# EAGLE design lasertag (EAGLE 5.07)
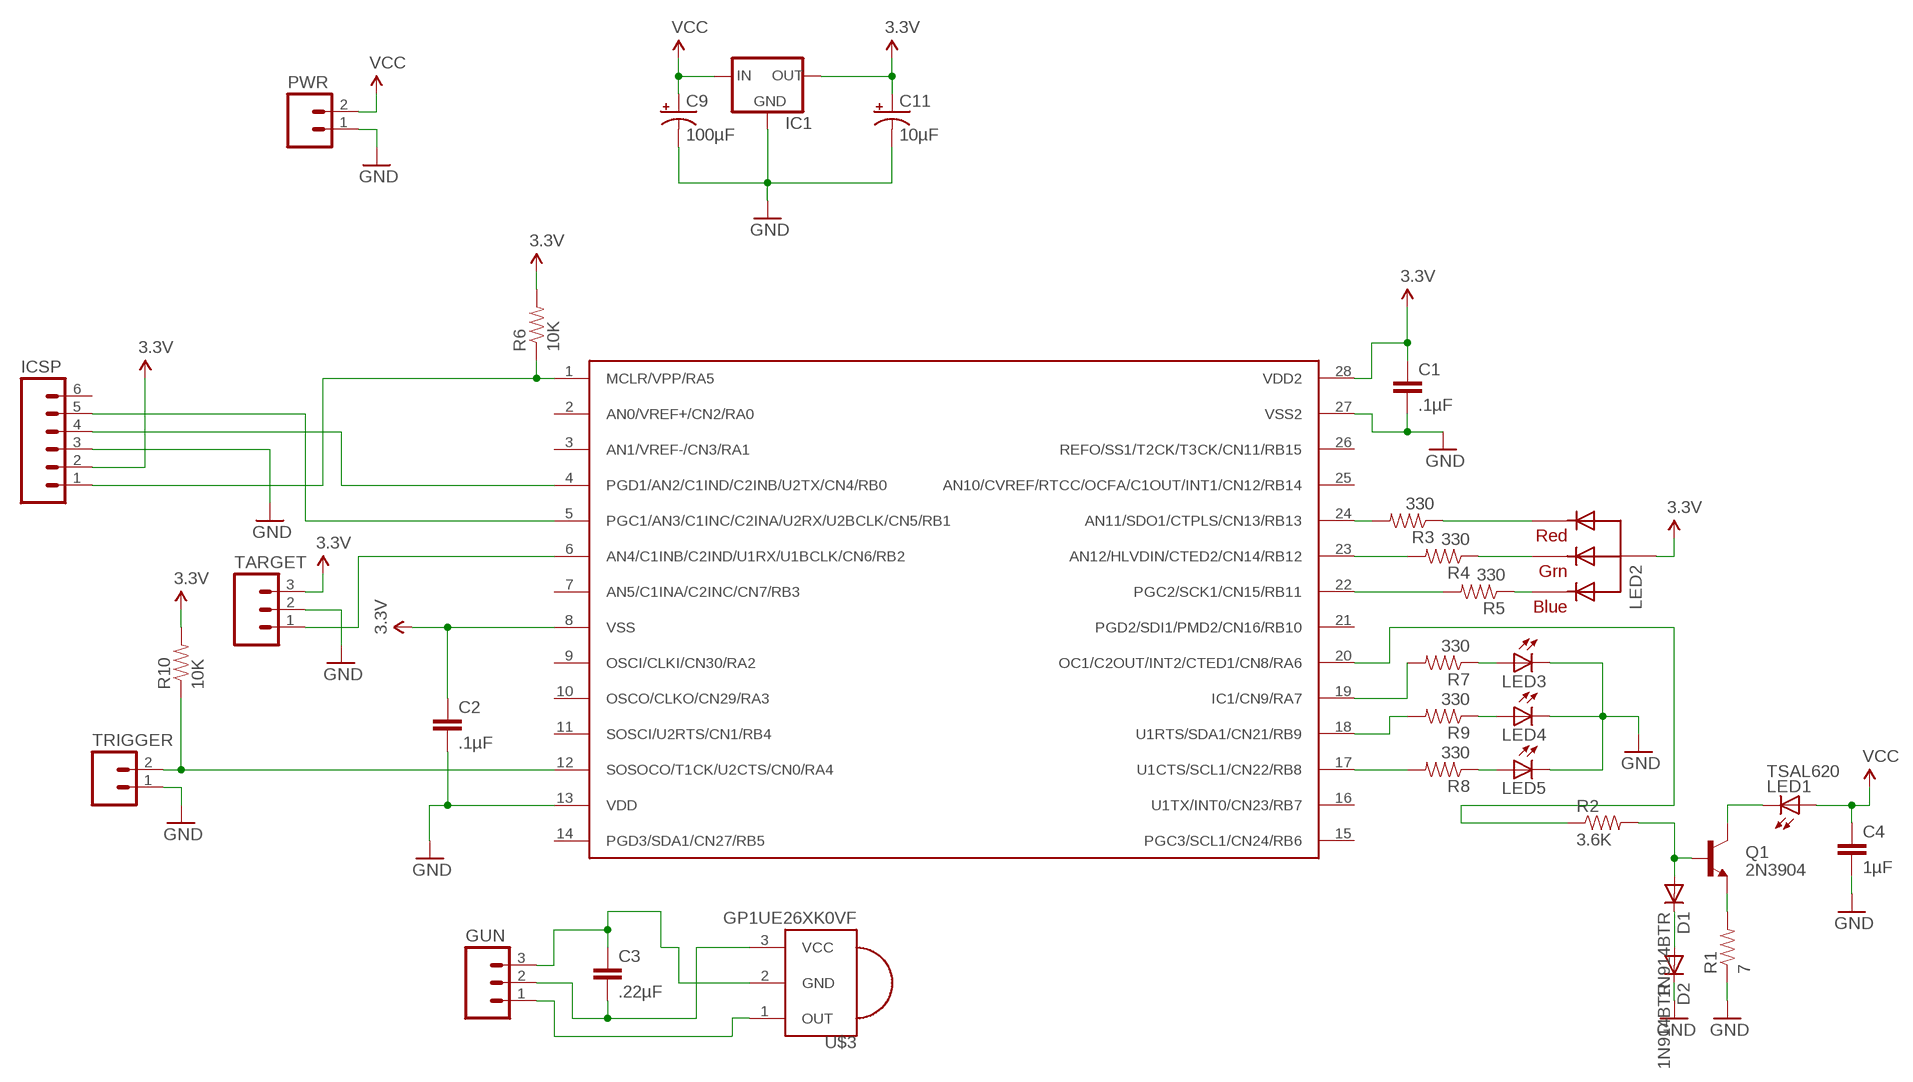
[diagram p0: schematic, sheet 1]

## Parts
C1  .1µF  CAPPTH  [CAP-PTH-SMALL]
C2  .1µF  CAPPTH  [CAP-PTH-SMALL]
C3  .22µF  CAPPTH2  [CAP-PTH-SMALL2]
C4  1µF  CAPPTH1  [CAP-PTH-5MM]
C9  100µF  CAP_POLPTH1  [CPOL-RADIAL-100UF-25V]
C11  10µF  CAP_POLPTH2  [CPOL-RADIAL-10UF-25V]
D1  1N914BTR  DIODE1N4148  [DIODE-1N4148]
D2  1N914BTR  DIODE1N4148  [DIODE-1N4148]
GUN  M03LOCK  [1X03_LOCK]
IC1  V_REG_78XXTO-92  [TO-92]
ICSP  M06LOCK  [1X06_LOCK]
LED1  TSAL620  LED5MM  [LED5MM]
LED2  RGBLED_CA-5MM  [LED5MMRGB]
LED3  LED3MM  [LED3MM]
LED4  LED3MM  [LED3MM]
LED5  LED3MM  [LED3MM]
PWR  M02LOCK  [1X02_LOCK]
Q1  2N3904  TRANSISTOR_NPNTO92  [TO-92]
R1  7  RESISTORPTH-1/4W  [AXIAL-0.4]
R2  3.6K  RESISTORPTH-1/4W  [AXIAL-0.4]
R3  330  RESISTORPTH-1/4W  [AXIAL-0.4]
R4  330  RESISTORPTH-1/4W  [AXIAL-0.4]
R5  330  RESISTORPTH-1/4W  [AXIAL-0.4]
R6  10K  RESISTORPTH-1/4W  [AXIAL-0.4]
R7  330  RESISTORPTH-1/4W  [AXIAL-0.4]
R8  330  RESISTORPTH-1/4W  [AXIAL-0.4]
R9  330  RESISTORPTH-1/4W  [AXIAL-0.4]
R10  10K  RESISTORPTH-1/4W  [AXIAL-0.4]
TARGET  M03LOCK  [1X03_LOCK]
TRIGGER  M02LOCK  [1X02_LOCK]
U$2  PIC24F16KA102  [DIL28]
U$3  GP1UE26XK0VF  PNA460XM  [PNA460XM]

## Nets
3.3V: C1.1 C2.1 C11.1(+) IC1.3(OUT) ICSP.2 LED2.2(VCC) R6.P$2 R10.P$2 TARGET.3 U$2.8(VSS) U$2.28(VDD2)
B: D1.A Q1.2(B) R2.P$2
C: LED1.K(C) Q1.3(C)
E: Q1.1(E) R1.P$2
GND: C1.2 C2.2 C4.2 C9.2(-) C11.2(-) D2.C IC1.1(GND) ICSP.3 LED3.K(C) LED4.K(C) LED5.K(C) PWR.1 R1.P$1 TARGET.2 TRIGGER.1 U$2.13(VDD) U$2.27(VSS2)
N$1: R7.P$2 U$2.19(IC1/CN9/RA7)
N$3: ICSP.1 R6.P$1 U$2.1(MCLR/VPP/RA5)
N$4: ICSP.4 U$2.4(PGD1/AN2/C1IND/C2INB/U2TX/CN4/RB0)
N$5: ICSP.5 U$2.5(PGC1/AN3/C1INC/C2INA/U2RX/U2BCLK/CN5/RB1)
N$7: D1.C D2.A
N$10: R2.P$1 U$2.20(OC1/C2OUT/INT2/CTED1/CN8/RA6)
N$12: R4.P$2 U$2.23(AN12/HLVDIN/CTED2/CN14/RB12)
N$13: R5.P$2 U$2.22(PGC2/SCK1/CN15/RB11)
N$14: LED2.3(GREEN) R4.P$1
N$15: LED2.4(BLUE) R5.P$1
N$16: TARGET.1 U$2.6(AN4/C1INB/C2IND/U1RX/U1BCLK/CN6/RB2)
N$17: LED3.A R7.P$1
N$18: LED4.A R9.P$1
N$19: R3.P$2 U$2.24(AN11/SDO1/CTPLS/CN13/RB13)
N$20: LED2.1(RED) R3.P$1
N$21: LED5.A R8.P$1
N$23: R9.P$2 U$2.18(U1RTS/SDA1/CN21/RB9)
N$24: R8.P$2 U$2.17(U1CTS/SCL1/CN22/RB8)
N$25: R10.P$1 TRIGGER.2 U$2.12(SOSOCO/T1CK/U2CTS/CN0/RA4)
TARGET_GND: C3.2 GUN.2 U$3.3(VCC)
TARGET_VCC: C3.1 GUN.3 U$3.2(GND)
TARGETOUT: GUN.1 U$3.1(OUT)
VCC: C4.1 C9.1(+) IC1.2(IN) LED1.A PWR.2
Unconnected: ICSP.6 U$2.2(AN0/VREF+/CN2/RA0) U$2.3(AN1/VREF-/CN3/RA1) U$2.7(AN5/C1INA/C2INC/CN7/RB3) U$2.9(OSCI/CLKI/CN30/RA2) U$2.10(OSCO/CLKO/CN29/RA3) U$2.11(SOSCI/U2RTS/CN1/RB4) U$2.14(PGD3/SDA1/CN27/RB5) U$2.15(PGC3/SCL1/CN24/RB6) U$2.16(U1TX/INT0/CN23/RB7) U$2.21(PGD2/SDI1/PMD2/CN16/RB10) U$2.25(AN10/CVREF/RTCC/OCFA/C1OUT/INT1/CN12/RB14) U$2.26(REFO/SS1/T2CK/T3CK/CN11/RB15)

## Library data of the parts
C1-C4 = SparkFun:CAP: Capacitor Standard 0603 ceramic capacitor, and 0.1" leaded capacitor.
C9 C11 = SparkFun:CAP_POL: Capacitor Polarized These are standard SMD and PTH capacitors. Normally 10uF, 47uF, and 100uF in electrolytic and tantalum varieties. Always verify the external diameter of the through hole cap, it varies with capacity, voltage, and manufacturer. The EIA devices should be standard.
D1 D2 = SparkFun:DIODE: Diode These are standard reverse protection diodes and small signal diodes. SMA package can handle up to about 1A. SOD-323 can handle about 200mA. What the SOD-323 package when ordering, there are some mfgs out there that are 5-pin packages.
GUN TARGET = SparkFun:M03: Header 3 Standard 3-pin 0.1" header. Use with straight break away headers (SKU : PRT-00116), right angle break away headers (PRT-00553), swiss pins (PRT-00743), machine pins (PRT-00117), and female headers (PRT-00115). Molex polarized connector foot print use with SKU : PRT-08232 with associated crimp pins and housings.
IC1 = SparkFun:V_REG_78XX: Voltage Regulator Standard 7805 5V regulator. IGO (Input Ground Output). Spark Fun Electronics SKU : COM-00107
ICSP = SparkFun:M06: Header 6 Standard 6-pin 0.1" header. Use with straight break away headers (SKU : PRT-00116), right angle break away headers (PRT-00553), swiss pins (PRT-00743), machine pins (PRT-00117), and female headers (PRT-00115). Molex polarized connector foot print use with SKU : PRT-08094 with associated crimp pins and housings. NOTES ON THE VARIANTS LOCK and LOCK_LONGPADS... This footprint was designed to help hold the alignment of a through-hole component (i.e. 6-pin header) while soldering it into place. You may notice that each hole has been shifted either up or down by 0.005 of an inch from it's more standard position (which is a perfectly straight line). This slight alteration caused the pins (the squares in the middle) to touch the edges of the holes. Because they are alternating, it causes a "brace" to hold the component in place. 0.005 has proven to be the perfect amount of "off-center" position when using our standard breakaway headers. Although looks a little odd when you look at the bare footprint, once you have a header in there, the alteration is very hard to notice. Also, if you push a header all the way into place, it is covered up entirely on the bottom side. This idea of altering the position of holes to aid alignment will be further integrated into the Sparkfun Library for other footprints. It can help hold any component with 3 or more connection pins.
LED1 LED3-LED5 = adafruit:LED: LED OSRAM: - CHIPLED LG R971, LG N971, LY N971, LG Q971, LY Q971, LO R971, LY R971 LH N974, LH R974 LS Q976, LO Q976, LY Q976 LO Q996 - Hyper CHIPLED LW Q18S LB Q993, LB Q99A, LB R99A - SideLED LS A670, LO A670, LY A670, LG A670, LP A670 LB A673, LV A673, LT A673, LW A673 LH A674 LY A675 LS A676, LA A676, LO A676, LY A676, LW A676 LS A679, LY A679, LG A679 - Hyper Micro SIDELED® LS Y876, LA Y876, LO Y876, LY Y876 LT Y87S - SmartLED LW L88C, LW L88S LB L89C, LB L89S, LG L890 LS L89K, LO L89K, LY L89K LS L896, LA L896, LO L896, LY L896 - TOPLED LS T670, LO T670, LY T670, LG T670, LP T670 LSG T670, LSP T670, LSY T670, LOP T670, LYG T670 LG T671, LOG T671, LSG T671 LB T673, LV T673, LT T673, LW T673 LH T674 LS T676, LA T676, LO T676, LY T676, LB T676, LH T676, LSB T676, LW T676 LB T67C, LV T67C, LT T67C, LS T67K, LO T67K, LY T67K, LW E67C LS E67B, LA E67B, LO E67B, LY E67B, LB E67C, LV E67C, LT E67C LW T67C LS T679, LY T679, LG T679 LS T770, LO T770, LY T770, LG T770, LP T770 LB T773, LV T773, LT T773, LW T773 LH T774 LS E675, LA E675, LY E675, LS T675 LS T776, LA T776, LO T776, LY T776, LB T776 LHGB T686 LT T68C, LB T68C - Hyper Mini TOPLED® LB M676 - Mini TOPLED Santana® LG M470 LS M47K, LO M47K, LY M47K Source: http://www.osram.convergy.de/
LED2 = adafruit:RGBLED_CA: RGB LED, common-anode 5MM Staggered pins 5mm Piranha package http://www.ladyada.net/library/pcb/eaglelibrary.html
PWR TRIGGER = SparkFun:M02: Header 2 Standard 2-pin 0.1" header. Use with straight break away headers (SKU : PRT-00116), right angle break away headers (PRT-00553), swiss pins (PRT-00743), machine pins (PRT-00117), and female headers (PRT-00115). Molex polarized connector foot print use with SKU : PRT-08233 with associated crimp pins and housings.
Q1 = SparkFun:TRANSISTOR_NPN: Transistor NPN BJT configuration in SOT23 package. MMBT2222 is the common NPN we use. Double check BCE configuration again layout.
R1-R10 = SparkFun:RESISTOR: Resistor Basic schematic elements and footprints for 0603, 1206, and PTH resistors.
U$2 = custom:PIC24F16KA102: 20/28-Pin General Purpose, 16-Bit Flash Microcontrollers with nanoWatt XLP? Technology
U$3 = adafruit:PNA460XM: IR 38KHz receiver PNA4602 and related receivers http://www.ladyada.net/library/pcb/eaglelibrary.html

## Net classes
0 default: width 0.406 mm
1 ground: width 2 mm
2 power: width 2 mm

## Board
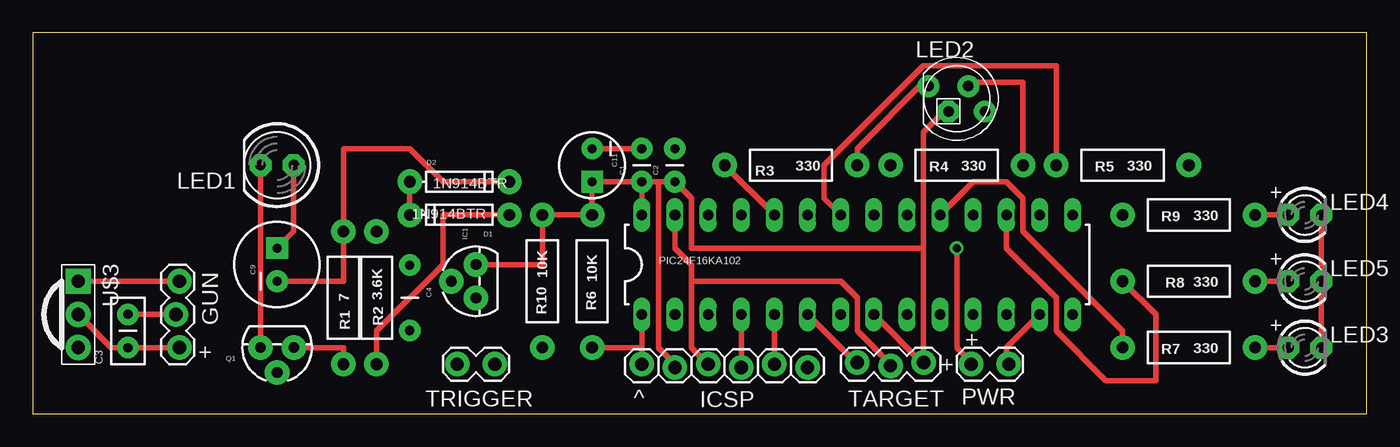
[diagram p1: board, top side]
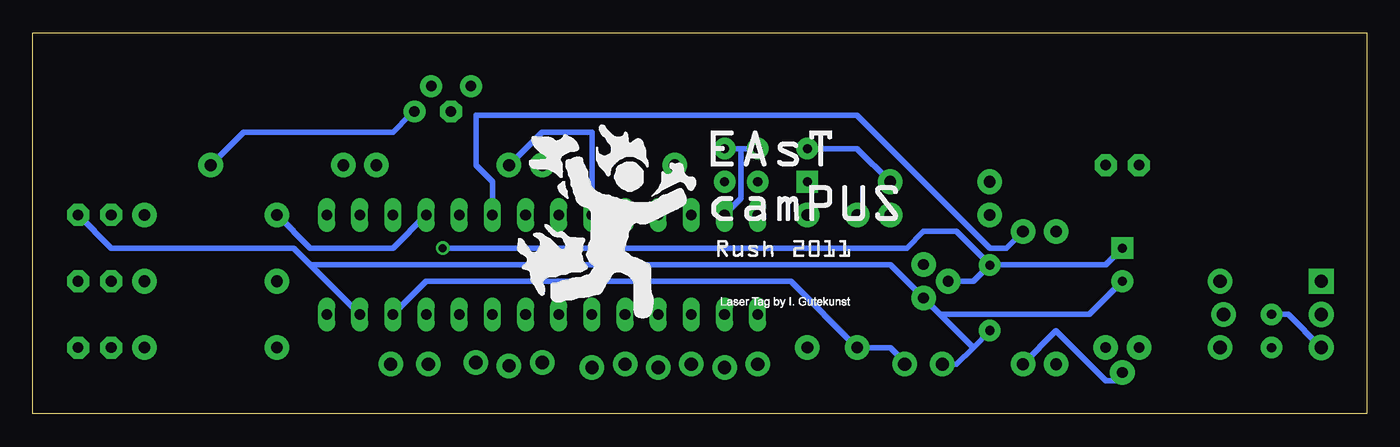
[diagram p2: board, bottom side, seen from below]

Size 102.22 x 29.2 mm. Coordinates in mm from the lower left corner, seen from the top.
Outline: 0,0 102.22,0 102.22,29.2 0,29.2 0,0
Copper layers (1*16): Top 0.0356mm / dielectric 1.5011mm / Bottom 0.0356mm
Design rules "typical_4pcb": minimum track width 10mil, minimum drill 15mil, track to track 6mil, track to pad 6mil, pad to pad 6mil, via to via 6mil, smd to smd 6mil, copper to edge 15mil, drill to drill 8mil, minimum pad ring 10mil, minimum via ring 8mil, stop-mask expansion 4mil, vias tented up to drill 0mil, thermal gap 10mil

### Footprints (pad centres in the part's own frame; a part is rotated, then mirrored left to right if it is on the bottom)
CAP-PTH-SMALL = drill 0.7 pad 1.651 round: 1 0,0; 2 2.54,0
CAP-PTH-SMALL2 = drill 0.7 pad 1.651 round: 1 0,0; 2 2.54,0
CAP-PTH-5MM = drill 0.7 pad 1.651 round: 1 -2.5,0; 2 2.5,0
CPOL-RADIAL-100UF-25V = drill 0.7 pad 1.651 square: 1 1.27,0 | drill 0.7 pad 1.651 round: 2 -1.27,0
CPOL-RADIAL-10UF-25V = drill 0.7 pad 1.651 square: 1 1.27,0 | drill 0.7 pad 1.651 round: 2 -1.27,0
DIODE-1N4148 = drill 0.9 pad 1.88 round: A -3.81,0; C 3.81,0
1X03_LOCK = drill 1.016 pad 1.88 round: 1 0,0.127; 2 2.54,-0.127; 3 5.08,0.127
TO-92 = drill 0.813 pad 1.88 round: 1 -1.27,0; 2 0,1.905; 3 1.27,0
1X06_LOCK = drill 1.016 pad 1.88 round: 1 0,0; 2 2.54,-0.254; 3 5.08,0; 4 7.62,-0.254; 5 10.16,0; 6 12.7,-0.254
LED5MM = drill 0.813 pad 1.676 octagon: A -1.27,0; K 1.27,0
LED5MMRGB = drill 0.8 pad 1.676 round: 1 -2.159,0.968; 3 0.889,0.968; 4 2.159,-0.968 | drill 0.8 pad 1.676 octagon: 2 -0.635,-0.968
LED3MM = drill 0.813 pad 1.676 octagon: A -1.27,0; K 1.27,0
1X02_LOCK = drill 1.016 pad 1.88 round: 1 -0.178,0; 2 2.718,0
AXIAL-0.4 = drill 0.9 pad 1.88 round: P$1 -5.08,0; P$2 5.08,0
DIL28 = drill 0.813 long: 1 -16.51,-3.81; 2 -13.97,-3.81; 3 -11.43,-3.81; 4 -8.89,-3.81; 5 -6.35,-3.81; 6 -3.81,-3.81; 7 -1.27,-3.81; 8 1.27,-3.81; 9 3.81,-3.81; 10 6.35,-3.81; 11 8.89,-3.81; 12 11.43,-3.81; 13 13.97,-3.81; 14 16.51,-3.81; 15 16.51,3.81; 16 13.97,3.81; 17 11.43,3.81; 18 8.89,3.81; 19 6.35,3.81; 20 3.81,3.81; 21 1.27,3.81; 22 -1.27,3.81; 23 -3.81,3.81; 24 -6.35,3.81; 25 -8.89,3.81; 26 -11.43,3.81; 27 -13.97,3.81; 28 -16.51,3.81
PNA460XM = drill 1.016 pad 1.93 square: 1 -2.54,0 | drill 1.016 pad 1.93 round: 2 0,0; 3 2.54,0

### Placement (x,y rotation side)
C1  46.67,17.78 90 top
C2  49.21,17.78 90 top
C3  7.3,5.08 90 top
C4  28.89,8.89 270 top
C9  18.73,11.43 90 top
C11  42.86,19.05 270 top
D1  32.7,15.24 180 top
D2  32.7,17.78 0 top
GUN  11.11,10.16 270 top
IC1  33.97,10.16 90 top
ICSP  46.67,3.81 0 top
LED1  18.73,19.05 180 top
LED2  70.8,24.13 0 top
LED3  97.47,5.08 0 top
LED4  97.47,15.24 0 top
LED5  97.47,10.16 0 top
PWR  74.61,3.81 180 top
Q1  18.73,5.08 180 top
R1  23.81,8.89 270 top
R2  26.35,8.89 270 top
R3  58.1,19.05 180 top
R4  70.8,19.05 180 top
R5  83.5,19.05 180 top
R6  42.86,10.16 90 top
R7  88.58,5.08 180 top
R8  88.58,10.16 180 top
R9  88.58,15.24 180 top
R10  39.05,10.16 90 top
TARGET  63.18,3.81 0 top
TRIGGER  32.7,3.81 0 top
U$2  63.18,11.43 0 top
U$3  3.49,7.62 270 top

### Tracks (layer width: path | path; a pad name or v marks a point on that pad's centre or on a via)
3.3V
  Top 0.406: U$2.8 68.26,3.81 TARGET.3 68.26,12.7 | 68.26,12.7 68.26,21.59 69.53,22.86 LED2.2 | IC1.3 39.05,11.43 R10.P$2 R6.P$2 C11.1 C1.1 | C1.1 U$2.28 | C1.1 47.94,17.78 | 47.94,17.78 C2.1 50.48,16.51 50.48,12.7 68.26,12.7 | 47.94,17.78 47.94,5.08 49.21,3.81 ICSP.2
B
  Top 0.406: D1.A 31.43,15.24 31.43,11.43 26.35,6.35 R2.P$2
  Bottom 0.406: R2.P$2 23.81,6.35 20,2.54 18.73,2.54 Q1.2
C
  Top 0.406: Q1.3 LED1.K
E
  Top 0.406: Q1.1 23.81,5.08 R1.P$2
GND
  Top 0.406: C11.2 C1.2 | ICSP.3 50.48,5.08 50.48,10.16 | 50.48,10.16 50.48,11.43 49.21,12.7 U$2.27 | 50.48,10.16 61.91,10.16 63.18,8.89 63.18,6.35 65.72,3.81 TARGET.2 | C9.2 23.81,10.16 R1.P$1 23.81,20.32 28.89,20.32 31.43,17.78 D2.C | U$2.13 74.61,5.08 74.61,3.81 PWR.1 | LED3.K LED5.K LED4.K
  Bottom 0.406: U$2.27 47.94,16.51 47.94,20.32 | C1.2 47.94,20.32 | 47.94,20.32 C2.2 | D2.C 39.05,20.32 C11.2 | 30.16,5.08 31.43,3.81 TRIGGER.1 32.7,3.81 | 30.16,5.08 28.89,6.35 C4.2 | 32.7,7.62 30.16,5.08 | 32.7,7.62 IC1.1 36.51,11.43 80.96,11.43 | C9.2 21.27,7.62 32.7,7.62 | 80.96,11.43 82.23,12.7 96.2,12.7 LED4.K | 80.96,11.43 U$2.13
N$1
  Top 0.406: U$2.19 72.07,17.78 74.61,17.78 75.88,16.51 75.88,13.97 83.5,6.35 R7.P$2
N$3
  Top 0.406: 46.67,5.08 ICSP.1 | 46.67,5.08 U$2.1 | R6.P$1 46.67,5.08
N$4
  Top 0.406: ICSP.4 U$2.4
N$5
  Top 0.406: ICSP.5 U$2.5
N$7
  Top 0.406: D1.C D2.A
N$10
  Bottom 0.406: U$2.20 66.99,17.78 68.26,19.05 68.26,22.86 39.05,22.86 28.89,12.7 27.62,12.7 R2.P$1
N$12
  Bottom 0.406: U$2.23 59.37,21.59 63.18,21.59 R4.P$2
N$13
  Top 0.406: U$2.22 60.64,16.51 60.64,19.05 68.26,26.67 78.42,26.67 R5.P$2
N$14
  Top 0.406: R4.P$1 75.88,25.4 72.07,25.4 LED2.3
N$15
  Bottom 0.406: R5.P$1 86.04,21.59 74.61,21.59 73.34,22.86 LED2.4
N$16
  Top 0.406: U$2.6 63.18,3.81 TARGET.1
N$17
  Top 0.406: R7.P$1 LED3.A
N$18
  Top 0.406: R9.P$1 LED4.A
N$19
  Top 0.406: R3.P$2 U$2.24
N$20
  Top 0.406: R3.P$1 63.18,20.32 68.26,25.4 LED2.1
N$21
  Top 0.406: R8.P$1 LED5.A
N$23
  Bottom 0.406: U$2.18 74.61,12.7 80.96,12.7 R9.P$2
N$24
  Top 0.406: U$2.17 74.61,12.7 78.42,8.89 78.42,6.35 82.23,2.54 86.04,2.54 86.04,7.62 R8.P$2
N$25
  Bottom 0.406: U$2.12 72.07,10.16 44.13,10.16 R10.P$1 36.51,5.08 35.24,3.81 TRIGGER.2
TARGET_GND
  Top 0.406: C3.2 GUN.2 11.11,7.62
  Bottom 0.406: U$3.3 6.03,7.62 C3.2
TARGET_VCC
  Top 0.406: GUN.3 C3.1 6.03,5.08 U$3.2
TARGETOUT
  Top 0.406: U$3.1 GUN.1
VCC  (via drill 0.61)
  Top 0.406: C9.1 20,13.97 LED1.A | v70.8,12.7 70.8,5.08 72.07,3.81 PWR.2
  Bottom 0.406: 28.89,11.43 30.16,10.16 IC1.2 | v70.8,12.7 35.24,12.7 33.97,13.97 31.43,13.97 28.89,11.43 | C9.1 20,11.43 28.89,11.43 | 28.89,11.43 C4.1

### Text on the board
tPlace: + | + | + | ^
bPlace: /Users/isaacg/Desktop/gtune/lasertag/hardware/RUSH LOGO.bmp